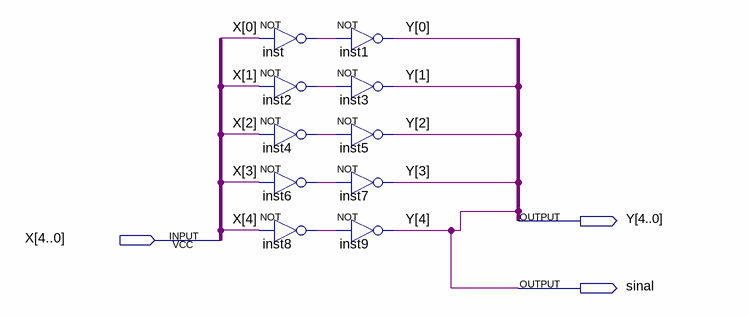
[diagram p0: schematic sheet]
// Quartus schematic takesinal.bdf as structural Verilog: 10 symbols, 3 pins
module takesinal (
  input  [4:0] X,
  output [4:0] Y,
  output sinal
);

  wire inst2_out, inst4_out, inst6_out, inst8_out, inst_out;

  not inst (inst_out, X[0]);
  not inst2 (inst2_out, X[1]);
  not inst4 (inst4_out, X[2]);
  not inst6 (inst6_out, X[3]);
  not inst8 (inst8_out, X[4]);
  not inst1 (Y[0], inst_out);
  not inst3 (Y[1], inst2_out);
  not inst5 (Y[2], inst4_out);
  not inst7 (Y[3], inst6_out);
  not inst9 (sinal, inst8_out);

  assign Y[4] = sinal;
endmodule
